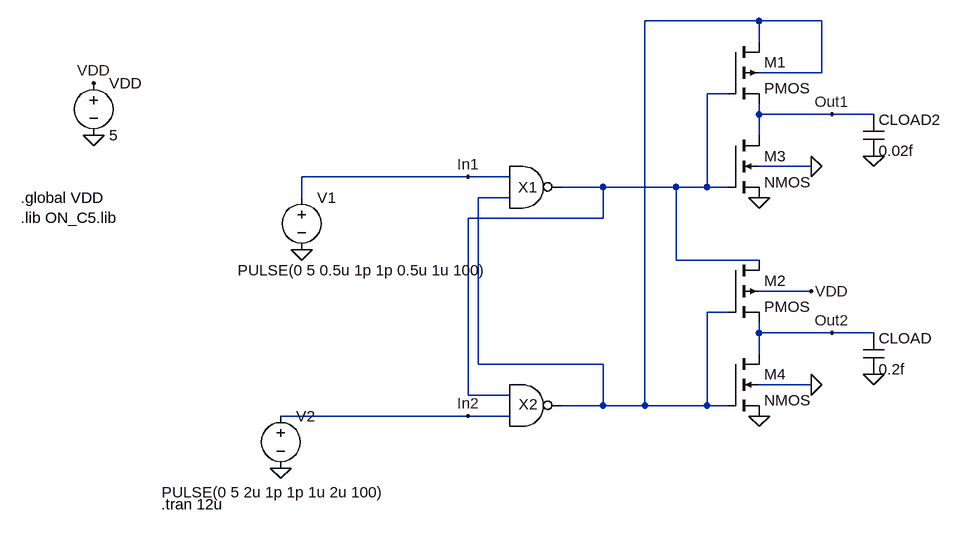
[diagram p0: schematic arbiter_circuit.asc]
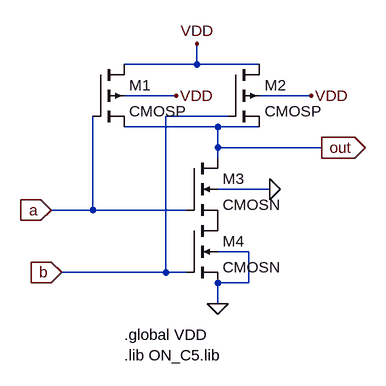
[diagram p1: sub-circuit nand.asc]
arbiter_circuit.asc, the LTspice schematic file:
Version 4
SHEET 1 880 680
WIRE 400 -176 224 -176
WIRE 496 -176 400 -176
WIRE 400 -144 400 -176
WIRE 496 -96 496 -176
WIRE 496 -96 400 -96
WIRE 352 -64 320 -64
WIRE 400 -32 400 -48
WIRE 512 -32 400 -32
WIRE 576 -32 512 -32
WIRE 400 0 400 -32
WIRE 480 48 400 48
WIRE -48 64 -304 64
WIRE 16 64 -48 64
WIRE 160 80 96 80
WIRE 272 80 160 80
WIRE 320 80 320 -64
WIRE 320 80 272 80
WIRE 352 80 320 80
WIRE -304 96 -304 64
WIRE 16 96 -32 96
WIRE 160 128 160 80
WIRE 160 128 -48 128
WIRE 272 192 272 80
WIRE 400 192 272 192
WIRE 480 240 400 240
WIRE 352 272 320 272
WIRE 400 304 400 288
WIRE 512 304 400 304
WIRE 576 304 512 304
WIRE 400 336 400 304
WIRE -32 352 -32 96
WIRE 160 352 -32 352
WIRE 480 384 400 384
WIRE -48 400 -48 128
WIRE 16 400 -48 400
WIRE 160 416 160 352
WIRE 160 416 96 416
WIRE 224 416 224 -176
WIRE 224 416 160 416
WIRE 320 416 320 272
WIRE 320 416 224 416
WIRE 352 416 320 416
WIRE -48 432 -336 432
WIRE 16 432 -48 432
FLAG -48 64 In1
FLAG -48 432 In2
FLAG 400 96 0
FLAG 400 432 0
FLAG 512 304 Out2
FLAG 480 48 0
FLAG 480 240 VDD
FLAG 480 384 0
FLAG -304 176 0
FLAG -336 512 0
FLAG 512 -32 Out1
FLAG 576 368 0
FLAG 576 32 0
FLAG -624 0 0
FLAG -624 -80 VDD
SYMBOL nand 48 80 R0
WINDOW 0 -19 0 Left 2
SYMATTR InstName X1
SYMBOL nand 48 416 R0
WINDOW 0 -18 -2 Left 2
SYMATTR InstName X2
SYMBOL pmos4 352 -144 R0
SYMATTR InstName M1
SYMBOL pmos4 352 192 R0
SYMATTR InstName M2
SYMBOL nmos4 352 0 R0
SYMATTR InstName M3
SYMBOL nmos4 352 336 R0
SYMATTR InstName M4
SYMBOL voltage -304 80 R0
WINDOW 3 -98 128 Left 2
WINDOW 123 0 0 Left 2
WINDOW 39 0 0 Left 2
SYMATTR Value PULSE(0 5 0.5u 1p 1p 0.5u 1u 100)
SYMATTR InstName V1
SYMBOL voltage -336 416 R0
WINDOW 3 -183 133 Left 2
WINDOW 123 0 0 Left 2
WINDOW 39 0 0 Left 2
SYMATTR Value PULSE(0 5 2u 1p 1p 1u 2u 100)
SYMATTR InstName V2
SYMBOL cap 560 304 R0
SYMATTR InstName CLOAD
SYMATTR Value 0.2f
SYMBOL cap 560 -32 R0
SYMATTR InstName CLOAD2
SYMATTR Value 0.02f
SYMBOL voltage -624 -96 R0
WINDOW 123 0 0 Left 2
WINDOW 39 0 0 Left 2
SYMATTR InstName VDD
SYMATTR Value 5
TEXT -520 568 Left 2 !.tran 12u
TEXT -736 96 Left 2 !.global VDD\n.lib ON_C5.lib

nand.asc, the sub-circuit schematic file:
Version 4
SHEET 1 900 680
WIRE 160 -32 160 -64
WIRE 160 -32 48 -32
WIRE 256 -32 160 -32
WIRE 128 16 48 16
WIRE 336 16 256 16
WIRE 208 48 112 48
WIRE 192 64 48 64
WIRE 256 64 192 64
WIRE 192 96 192 64
WIRE 352 96 192 96
WIRE 192 112 192 96
WIRE 272 160 192 160
WIRE 0 192 0 48
WIRE 0 192 -64 192
WIRE 144 192 0 192
WIRE 240 256 192 256
WIRE 112 288 112 48
WIRE 112 288 -48 288
WIRE 144 288 112 288
WIRE 240 304 240 256
WIRE 240 304 192 304
WIRE 192 336 192 304
FLAG 352 96 out
IOPIN 352 96 Out
FLAG -64 192 a
IOPIN -64 192 In
FLAG 192 336 0
FLAG 160 -64 VDD
FLAG -48 288 b
IOPIN -48 288 In
FLAG 336 16 VDD
FLAG 128 16 VDD
FLAG 272 160 0
SYMBOL pmos4 0 -32 R0
SYMATTR InstName M1
SYMATTR Value CMOSP
SYMATTR Value2 l=0.6u w=1.8u
SYMBOL pmos4 208 -32 R0
SYMATTR InstName M2
SYMATTR Value CMOSP
SYMATTR Value2 l=0.6u w=1.8u
SYMBOL nmos4 144 112 R0
SYMATTR InstName M3
SYMATTR Value CMOSN
SYMATTR Value2 l=0.6u w=1.8u
SYMBOL nmos4 144 208 R0
SYMATTR InstName M4
SYMATTR Value CMOSN
SYMATTR Value2 l=0.6u w=1.8u
TEXT 48 384 Left 2 !.global VDD\n.lib ON_C5.lib

The netlist it stands for:
* arbiter_circuit.asc
XX1 In1 N001 N002 nand
XX2 N002 In2 N001 nand
M1 N001 N002 Out1 N001 PMOS
M2 N002 N001 Out2 VDD PMOS
M3 Out1 N002 0 0 NMOS
M4 Out2 N001 0 0 NMOS
V1 In1 0 PULSE(0 5 0.5u 1p 1p 0.5u 1u 100)
V2 In2 0 PULSE(0 5 2u 1p 1p 1u 2u 100)
CLOAD Out2 0 0.2f
CLOAD2 Out1 0 0.02f
VDD VDD 0 5

* block symbol definitions
.subckt nand a b out
M1 VDD a out VDD CMOSP l=0.6u w=1.8u
M2 VDD b out VDD CMOSP l=0.6u w=1.8u
M3 out a P001 0 CMOSN l=0.6u w=1.8u
M4 P001 b 0 0 CMOSN l=0.6u w=1.8u
.global VDD
.lib ON_C5.lib
.ends nand

.model NMOS NMOS
.model PMOS PMOS
.lib standard.mos
.tran 12u
.global VDD
.lib ON_C5.lib
.backanno
.end